# Altium schematic sheet USBJTAG_USBUART_4-Channel.SchDoc
size A3; DocumentNumber: 47; SheetNumber: 47; SheetTotal: 47
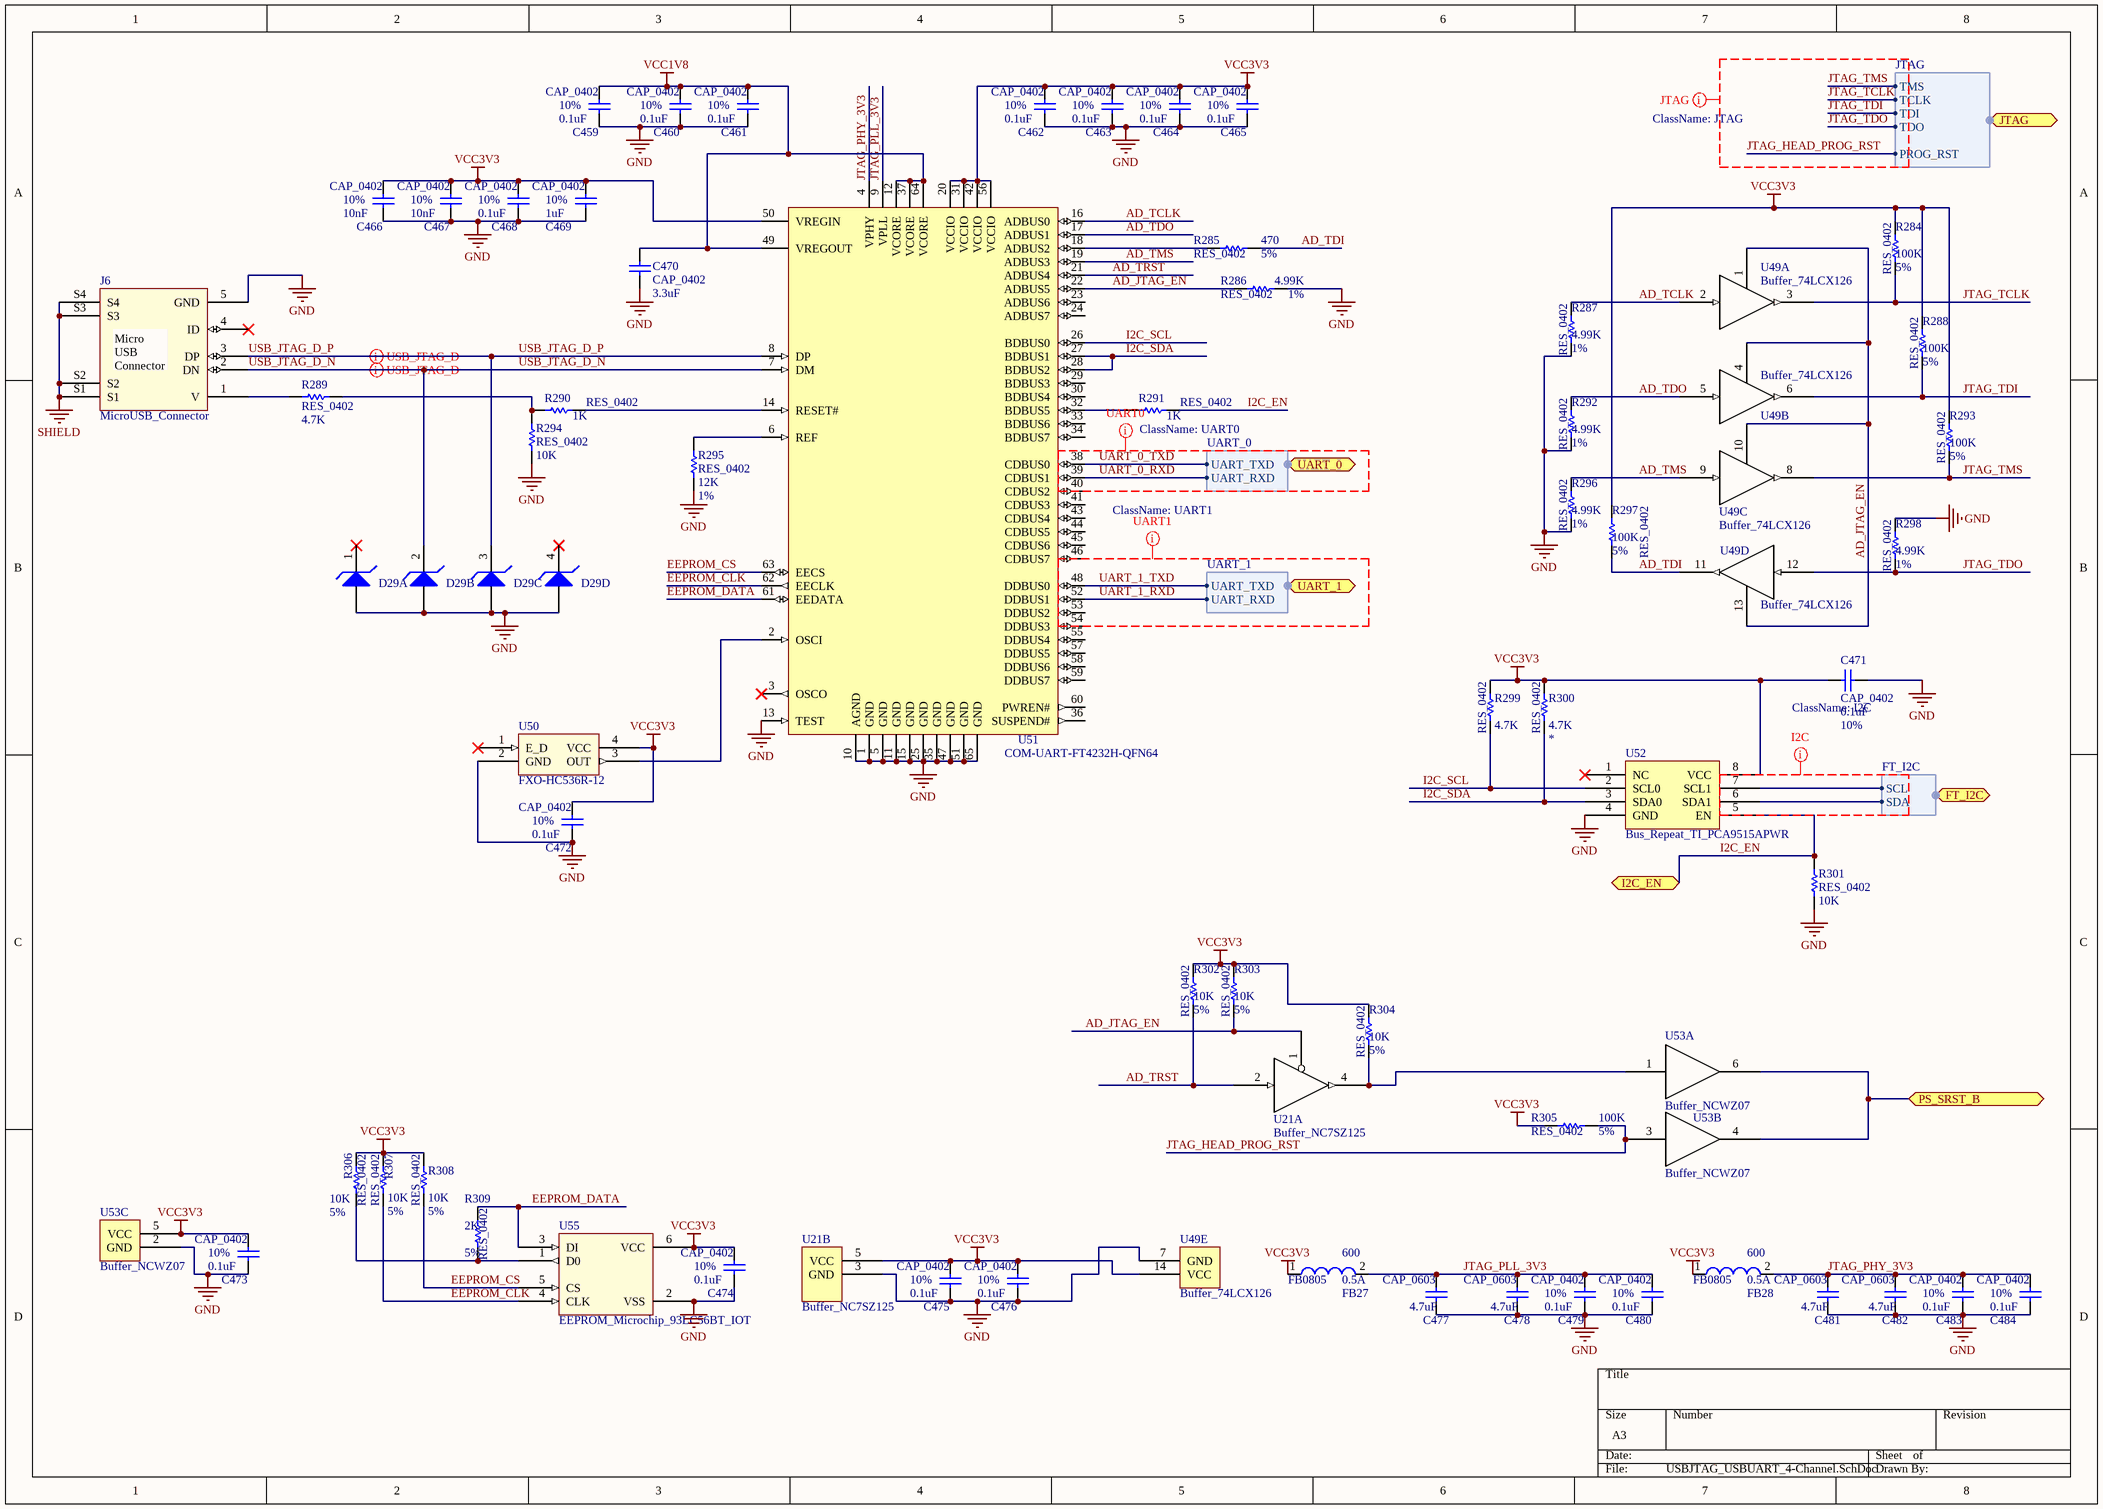
[diagram p0: USBJTAG_USBUART_4-Channel.SchDoc]

## Parts
C459  CAP_0402  value 0.1uF  Tolerance: 10%  [CAPC0402(1005)60_N]
C460  CAP_0402  value 0.1uF  Tolerance: 10%  [CAPC0402(1005)60_N]
C461  CAP_0402  value 0.1uF  Tolerance: 10%  [CAPC0402(1005)60_N]
C462  CAP_0402  value 0.1uF  Tolerance: 10%  [CAPC0402(1005)60_N]
C463  CAP_0402  value 0.1uF  Tolerance: 10%  [CAPC0402(1005)60_N]
C464  CAP_0402  value 0.1uF  Tolerance: 10%  [CAPC0402(1005)60_N]
C465  CAP_0402  value 0.1uF  Tolerance: 10%  [CAPC0402(1005)60_N]
C466  CAP_0402  value 10nF  Tolerance: 10%  [CAPC0402(1005)60_N]
C467  CAP_0402  value 10nF  Tolerance: 10%  [CAPC0402(1005)60_N]
C468  CAP_0402  value 0.1uF  Tolerance: 10%  [CAPC0402(1005)60_N]
C469  CAP_0402  value 1uF  Tolerance: 10%  [CAPC0402(1005)60_N]
C470  CAP_0402  value 3.3uF  [CAPC0402(1005)60_N]
C471  CAP_0402  value 0.1uF  Tolerance: 10%  [CAPC0402(1005)60_N]
C472  CAP_0402  value 0.1uF  Tolerance: 10%  [CAPC0402(1005)60_N]
C473  CAP_0402  value 0.1uF  Tolerance: 10%  [CAPC0402(1005)60_N]
C474  CAP_0402  value 0.1uF  Tolerance: 10%  [CAPC0402(1005)60_N]
C475  CAP_0402  value 0.1uF  Tolerance: 10%  [CAPC0402(1005)60_N]
C476  CAP_0402  value 0.1uF  Tolerance: 10%  [CAPC0402(1005)60_N]
C477  CAP_0603  value 4.7uF  [CAPC0603(1608)100_N]
C478  CAP_0603  value 4.7uF  [CAPC0603(1608)100_N]
C479  CAP_0402  value 0.1uF  Tolerance: 10%  [CAPC0402(1005)60_N]
C480  CAP_0402  value 0.1uF  Tolerance: 10%  [CAPC0402(1005)60_N]
C481  CAP_0603  value 4.7uF  [CAPC0603(1608)100_N]
C482  CAP_0603  value 4.7uF  [CAPC0603(1608)100_N]
C483  CAP_0402  value 0.1uF  Tolerance: 10%  [CAPC0402(1005)60_N]
C484  CAP_0402  value 0.1uF  Tolerance: 10%  [CAPC0402(1005)60_N]
D29  QuadESDDiode_TEConnectivity_SESD0802Q4UG  [QuadESDDiode_TEConnectivity_SESD0802Q4UG_5-PIN]  (value not drawn)  (parts A,B,C,D of 4)
FB27  FB0805  Resistance: 600  Max_Current: 0.5A  [Inductor0805(2012)]
FB28  FB0805  Resistance: 600  Max_Current: 0.5A  [Inductor0805(2012)]
J6  MicroUSB_Connector  [MicroUSB_ConnReceptacle_Hirose_ZX62-B-5PA(11)_pcb]
R284  RES_0402  value 100K  Tolerance: 5%  [RESC0402(1005)_N]
R285  RES_0402  value 470  Tolerance: 5%  [RESC0402(1005)_N]
R286  RES_0402  value 4.99K  Tolerance: 1%  [RESC0402(1005)_N]
R287  RES_0402  value 4.99K  Tolerance: 1%  [RESC0402(1005)_N]
R288  RES_0402  value 100K  Tolerance: 5%  [RESC0402(1005)_N]
R289  RES_0402  value 4.7K  [RESC0402(1005)_N]
R290  RES_0402  value 1K  [RESC0402(1005)_N]
R291  RES_0402  value 1K  [RESC0402(1005)_N]
R292  RES_0402  value 4.99K  Tolerance: 1%  [RESC0402(1005)_N]
R293  RES_0402  value 100K  Tolerance: 5%  [RESC0402(1005)_N]
R294  RES_0402  value 10K  [RESC0402(1005)_N]
R295  RES_0402  value 12K  Tolerance: 1%  [RESC0402(1005)_N]
R296  RES_0402  value 4.99K  Tolerance: 1%  [RESC0402(1005)_N]
R297  RES_0402  value 100K  Tolerance: 5%  [RESC0402(1005)_N]
R298  RES_0402  value 4.99K  Tolerance: 1%  [RESC0402(1005)_N]
R299  RES_0402  value 4.7K  [RESC0402(1005)_N]
R300  RES_0402  value 4.7K  [RESC0402(1005)_N]
R301  RES_0402  value 10K  [RESC0402(1005)_N]
R302  RES_0402  value 10K  Tolerance: 5%  [RESC0402(1005)_N]
R303  RES_0402  value 10K  Tolerance: 5%  [RESC0402(1005)_N]
R304  RES_0402  value 10K  Tolerance: 5%  [RESC0402(1005)_N]
R305  RES_0402  value 100K  Tolerance: 5%  [RESC0402(1005)_N]
R306  RES_0402  value 10K  Tolerance: 5%  [RESC0402(1005)_N]
R307  RES_0402  value 10K  Tolerance: 5%  [RESC0402(1005)_N]
R308  RES_0402  value 10K  Tolerance: 5%  [RESC0402(1005)_N]
R309  RES_0402  value 2K  Tolerance: 5%  [RESC0402(1005)_N]
U21  Buffer_NC7SZ125  [Buffer_Fairchild_NC7SZ125_SOT95P280X145-5N]  (parts A,B of 2)
U49  Buffer_74LCX126  [Buffer_Fairchild_74LCX126_DQFN-14]  (parts A,B,C,D,E of 5)
U50  FXO-HC536R-12  [Oscillator_Fox_767-12-69_HC5]
U51  COM-UART-FT4232H-QFN64  [FTDI_FT4232HQ_QFN64_2_N]
U52  Bus_Repeat_TI_PCA9515APWR  [Bus_Repeat_TI_PCA9515APWR_8-TSSOP]
U53  Buffer_NCWZ07  [Buffer_Fairchild_NCWZ07_SC70-6]  (parts A,B,C of 3)
U55  EEPROM_Microchip_93LC56BT_IOT  [EEPROM_Microchip_93LC56BT_IOT_SOT23-6]

## Ports
FT_I2C (harness FT_I2C), I2C_EN, JTAG (harness JTAG), PS_SRST_B (bidir), UART_0 (harness UART_0), UART_1 (harness UART_1)

## Harnesses
JTAG: TMS, TCLK, TDI, TDO, PROG_RST
UART_0: UART_TXD, UART_RXD
UART_1: UART_TXD, UART_RXD
FT_I2C: SCL, SDA

## Nets
GND: C459.1 C460.1 C461.1 C462.1 C463.1 C464.1 C465.1 C466.1 C467.1 C468.1 C469.1 C470.1 C471.1 C472.1 C473.1 C474.1 C475.1 C476.1 C477.1 C478.1 C479.1 C480.1 C481.1 C482.1 C483.1 C484.1 D29.G(A) J6.5(GND) R286.2 R287.1 R292.1 R294.1 R295.1 R296.1 R298.2 R301.1 U21.3(GND) U49.7(GND) U50.2(GND) U51.1(GND) U51.5(GND) U51.10(AGND) U51.11(GND) U51.13(TEST) U51.15(GND) U51.25(GND) U51.35(GND) U51.47(GND) U51.51(GND) U51.65(GND) U52.4(GND) U53.2(GND) U55.2(VSS)
SHIELD: J6.S1 J6.S2 J6.S3 J6.S4
VCC1V8: C459.2 C460.2 C461.2 C470.2 U51.12(VCORE) U51.37(VCORE) U51.49(VREGOUT) U51.64(VCORE)
VCC3V3: C462.2 C463.2 C464.2 C465.2 C466.2 C467.2 C468.2 C469.2 C471.2 C472.2 C473.2 C474.2 C475.2 C476.2 FB27.1 FB28.1 R284.2 R288.2 R293.2 R297.2 R299.2 R300.2 R302.2 R303.2 R304.2 R305.2 R306.2 R307.2 R308.2 U21.5(VCC) U49.14(VCC) U50.4(VCC) U51.20(VCCIO) U51.31(VCCIO) U51.42(VCCIO) U51.50(VREGIN) U51.56(VCCIO) U52.8(VCC) U53.5(VCC) U55.6(VCC)
AD_JTAG_EN: R286.1 R303.1 U21.1 U49.1 U49.4 U49.10 U49.13 U51.22(ADBUS5)
AD_TCLK: R287.2 U49.2 U51.16(ADBUS0)
AD_TDI: R285.2 R297.1 U49.11
AD_TDO: R292.2 U49.5 U51.17(ADBUS1)
AD_TMS: R296.2 U49.9 U51.19(ADBUS3)
AD_TRST: R302.1 U21.2 U51.21(ADBUS4)
EEPROM_CLK: R307.1 U51.62(EECLK) U55.4(CLK)
EEPROM_CS: R308.1 U51.63(EECS) U55.5(CS)
EEPROM_DATA: R309.2 U51.61(EEDATA) U55.3(DI)
I2C_EN: R291.2 R301.2 U52.5(EN) ; port I2C_EN
I2C_SCL: R299.1 U51.26(BDBUS0) U52.2(SCL0)
I2C_SDA: R300.1 U51.27(BDBUS1) U51.28(BDBUS2) U52.3(SDA0)
JTAG_HEAD_PROG_RST: R305.1 U53.3 ; port JTAG.PROG_RST
JTAG_PHY_3V3: C481.2 C482.2 C483.2 C484.2 FB28.2 U51.4(VPHY)
JTAG_PLL_3V3: C477.2 C478.2 C479.2 C480.2 FB27.2 U51.9(VPLL)
JTAG_TCLK: R284.1 U49.3 ; port JTAG.TCLK
JTAG_TDI: R288.1 U49.6 ; port JTAG.TDI
JTAG_TDO: R298.1 U49.12 ; port JTAG.TDO
JTAG_TMS: R293.1 U49.8 ; port JTAG.TMS
PS_SRST_B: U53.4 U53.6 ; port PS_SRST_B
UART_0_RXD: U51.39(CDBUS1) ; port UART_0.UART_RXD
UART_0_TXD: U51.38(CDBUS0) ; port UART_0.UART_TXD
UART_1_RXD: U51.52(DDBUS1) ; port UART_1.UART_RXD
UART_1_TXD: U51.48(DDBUS0) ; port UART_1.UART_TXD
USB_JTAG_D_N: D29.2(K) J6.2(DN) U51.7(DM)
USB_JTAG_D_P: D29.3(K) J6.3(DP) U51.8(DP)
NetJ6_1: J6.1(V) R289.1
NetR285_1: R285.1 U51.18(ADBUS2)
NetR289_2: R289.2 R290.1 R294.2
NetR290_2: R290.2 U51.14(RESET#)
NetR291_1: R291.1 U51.32(BDBUS5)
NetR295_2: R295.2 U51.6(REF)
NetR304_1: R304.1 U21.4 U53.1
NetR306_1: R306.1 R309.1 U55.1(D0)
NetU50_3: U50.3(OUT) U51.2(OSCI)
NetU52_6: U52.6(SDA1) ; port FT_I2C.SDA
NetU52_7: U52.7(SCL1) ; port FT_I2C.SCL

Not connected (* = marked no-connect by the designer): D29 1(K)* 4(K)*; J6 4(ID)*; U50 1(E_D)*; U51 3(OSCO)* 23(ADBUS6) 24(ADBUS7) 29(BDBUS3) 30(BDBUS4) 33(BDBUS6) 34(BDBUS7) 36(SUSPEND#) 40(CDBUS2) 41(CDBUS3) 43(CDBUS4) 44(CDBUS5) 45(CDBUS6) 46(CDBUS7) 53(DDBUS2) 54(DDBUS3) 55(DDBUS4) 57(DDBUS5) 58(DDBUS6) 59(DDBUS7) 60(PWREN#); U52 1(NC)*

## Layout directives
differential pair: USB_JTAG_D_N, USB_JTAG_D_P
net class UART1: UART_1_RXD, UART_1_TXD
net class UART0: UART_0_RXD, UART_0_TXD
net class I2C: (no net found under the mark)
net class JTAG: JTAG_HEAD_PROG_RST, JTAG_TCLK, JTAG_TDI, JTAG_TDO, JTAG_TMS

## Notes on the sheet
- (in symbol ZX62-B-5PA(11)) Micro USB / Connector

## Library data of the parts
C459-C465 C468 C471-C476 C479 C480 C483 C484 = CAP_0402: 0.1uf, ceramic, 10%, 6.3V, X5R, 0402; Part Number: C1005X5R0J104K; Manufacturer: TDK Corporation; Footprint Ref: CAPC0402(1005)60_N; Library Ref: CAP_0402
C466 C467 = CAP_0402: 10000pF, ceramic, 10% 6.3V X5R, 0402; Part Number: GRM155R60J103KA01D; Manufacturer: Murata Electronics North America; Footprint Ref: CAPC0402(1005)60_N; Library Ref: CAP_0402
C469 = CAP_0402: 1uF, ceramic, 10%, 6.3V, X5R, 0402; Part Number: C1005X5R0J105K; Manufacturer: TDK Corporation; Footprint Ref: CAPC0402(1005)60_N; Library Ref: CAP_0402
C470 = C1005X5R0J335M050BC: CAP CER 3.3UF 6.3V 20% X5R 0402; Manufacturer: TDK Corporation; Tolerance: 20%; Part Number: C1005X5R0J335M050BC
C477 C478 C481 C482 = LMK107BJ475KA-T: 4.7uF, ceramic, 10%, 10V X5R, 0603; Manufacturer: Taiyo Yuden; Tolerance: 10%; Part Number: LMK107BJ475KA-T
D29 = RF2197-000: SESD0802Q4UG, Quad Diode Array for ESD protection; Part Number: RF2197-000; Manufacturer: TE Connectivity
FB27 FB28 = FerriteBead0805: MPZ2012S601A, 600 ohm, 100MHz, 0805; Manufacturer: TDK Corporation; Value: 600; Part Number: MPZ2012S601A; Footprint Ref: Inductor0805(2012); Library Ref: FerriteBead0805
J6 = ZX62-B-5PA(11): CONN RCPT MICRO USB B SMD R/A; Manufacturer: Hirose Electric Co Ltd; Part Number: ZX62-B-5PA(11)
R284 R288 R293 R297 R305 = RES_0402: 100K ohm, 5%, 1/16W, 0402; Part Number: RC0402JR-07100KL; Manufacturer: Yageo America; Library Ref: RES_0402; Footprint Ref: RESC0402(1005)_N
R285 = RES_0402: 470 ohm, 5%, 1/16W, 0402; Part Number: MCR01MZPJ471; Manufacturer: ROHM; Library Ref: RES_0402; Footprint Ref: RESC0402(1005)_N
R286 R287 R292 R296 R298 = RES_0402: 4.99K ohm, 1% 1/16W, 0402; Part Number: CRCW04024K99FKED; Manufacturer: Vishay/Dale; Library Ref: RES_0402; Footprint Ref: RESC0402(1005)_N
R289 R299 R300 = RC0402JR-074K7L: 4.7K ohm, 5%, 1/16W, 0402; Manufacturer: Yageo America; Part Number: RC0402JR-074K7L
  R289 R299: Tolerance: 5%
  R300: Tolerance: *
R290 R291 = RC0402JR-071KL: 1K ohm, 5%, 1/16W, 0402; Manufacturer: Yageo America; Tolerance: 5%; Part Number: RC0402JR-071KL
R294 R301 = RC0402JR-0710KL: 10K ohm, 5%, 1/16W, 0402; Manufacturer: Yageo America; Tolerance: 5%; Part Number: RC0402JR-0710KL
R295 = RES_0402: 12K ohm, 1% 1/10W, 0402; Part Number: ERJ-2RKF1202X; Manufacturer: Panasonic - ECG; Library Ref: RES_0402; Footprint Ref: RESC0402(1005)_N
R302-R304 R306-R308 = RES_0402: 10K ohm, 5%, 1/16W, 0402; Part Number: RC0402JR-0710KL; Manufacturer: Yageo America; Library Ref: RES_0402; Footprint Ref: RESC0402(1005)_N
R309 = RES_0402: 2K ohm, 5% 1/16W, 0402; Part Number: ERJ-2GEJ202X; Manufacturer: Panasonic - ECG; Library Ref: RES_0402; Footprint Ref: RESC0402(1005)_N
U21 = NC7SZ125M5X: NC7SZ125M5X, Tri-State Buffer UHS, SOT-23; Manufacturer: FAIRCHILD SEMICONDUCTOR; Part Number: NC7SZ125M5X
U49 = Buffer_74LCX126: 74LCX126BQX, quad buffer, LV N-Inv, DQFN14; Manufacturer: FAIRCHILD SEMICONDUCTOR; Part Number: 74LCX126BQX; Footprint Ref: Buffer_Fairchild_74LCX126_DQFN-14; Library Ref: Buffer_Fairchild_74LCX126
U50 = FXO-HC536R-12: 767-12-69, 12MHz 3.3V HCMOS Oscillator, HC5; Manufacturer: Fox Electronics; Part Number: FXO-HC536R-12
U51 = FT4232HQ-REEL: IC USB HS QUAD UART/SYNC 64-QFN; Manufacturer: FTDI, Future Technology Devices International Ltd; Part Number: FT4232HQ-REEL
U52 = PCA9515APWR: IC DUAL BIDIR BUS REPEAT 8-TSSOP; Manufacturer: Texas Instruments; Part Number: PCA9515APWR
U53 = NC7WZ07P6X: NC7WZ07, dual non-inverting buffer, SC-70-6 (SOT-363); Manufacturer: FAIRCHILD OPTOELECTRICS GROUP; Part Number: NC7WZ07P6X; Footprint Ref: Buffer_Fairchild_NCWZ07_SC70-6; Library Ref: Buffer_Fairchild_NCWZ07
U55 = EEPROM_Microchip_93LC56BT_IOT: 93LC56BT-I/OT, EEPROM 2Kbit 3MHz, SOT23-6; Manufacturer: Microchip Technology; Part Number: 93LC56BT-I/OT; Footprint Ref: EEPROM_Microchip_93LC56BT_IOT_SOT23-6; Library Ref: EEPROM_Microchip_93LC56BT_IOT